# Altium schematic sheet BlockDetector2.SchDoc
size A3
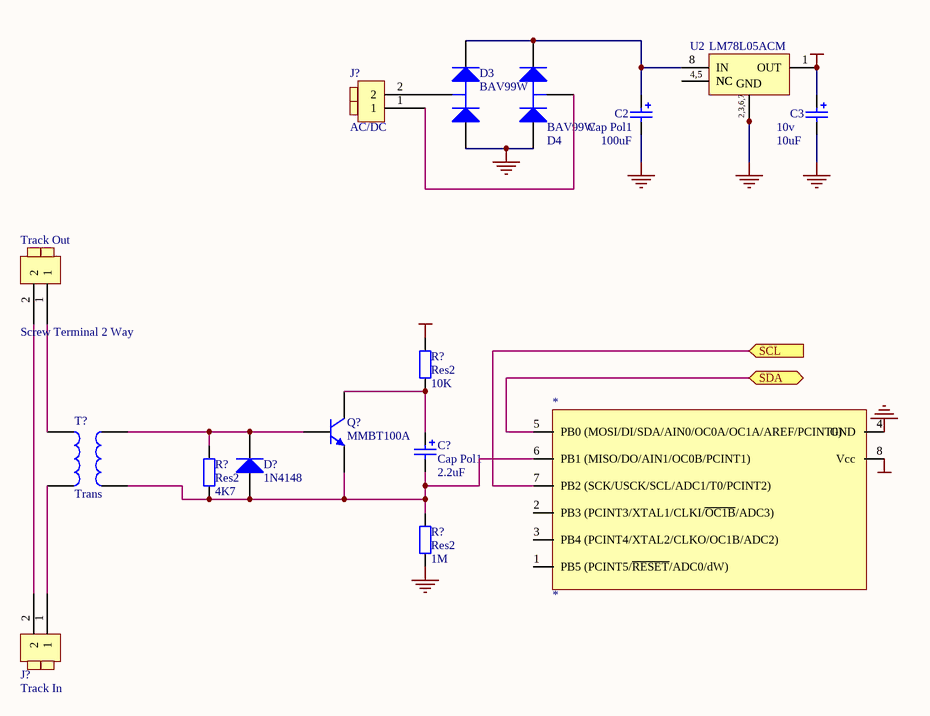
[diagram p0: BlockDetector2.SchDoc]

## Parts
(Parts that share a designator on the sheet are numbered #1, #2 ... from top to bottom, then left to right.)
*  *  [8P3]
C2  Cap Pol1  value 100uF  [CAPPR5-10X10.5]
C3  10v  value 10uF  [CC3216-1206]
C?  Cap Pol1  value 2.2uF  [RB7.6-15]
D3  BAV99W  [SOT-323]
D4  BAV99W  [SOT-323]
D?  1N4148  [DIO7.1-3.9x1.9]
J?#1  AC/DC  [Screw Terminal 2 way 0.2]
J?#2  Track In  [Screw Terminal 2 way 0.2]
Q?  MMBT100A  [SO-G3]
R?#1  Res2  value 10K  [AXIAL-0.4]
R?#2  Res2  value 4K7  [CR2012-0805]
R?#3  Res2  value 1M  [AXIAL-0.4]
T?  Trans  [TRANS]
Track_Out  Screw Terminal 2 Way  [Screw Terminal 2 way 0.2]
U2  LM78L05ACM  [M08A]

## Ports
SCL (in), SDA (bidir)

## Nets
GND: *.4(GND) C2.2 C3.2 D3.1(A) D4.1(A) R?#3.1 U2.2(GND) U2.3(GND) U2.6(GND) U2.7(GND)
VCC: *.8(Vcc) C3.1 R?#1.2 U2.1(OUT)
SCL: *.7(PB2_(SCK/USCK/SCL/ADC1/T0/PCINT2)) ; port SCL
SDA: *.5(PB0_(MOSI/DI/SDA/AIN0/OC0A/OC1A/AREF/PCINT0)) ; port SDA
Net*_6: *.6(PB1_(MISO/DO/AIN1/OC0B/PCINT1)) C?.2 D?.1(A) Q?.2(E) R?#2.1 R?#3.2 T?.4
NetC2_1: C2.1 D3.2(K) D4.2(K) U2.8(IN)
NetC?_1: C?.1 Q?.3(C) R?#1.1
NetD3_3: D3.3(C) J?#1.2
NetD4_3: D4.3(C) J?#1.1
NetD?_2: D?.2(K) Q?.1(B) R?#2.2 T?.3
NetJ?#2_1: J?#2.1 T?.2
NetJ?#2_2: J?#2.2 Track_Out.2
NetT?_1: T?.1 Track_Out.1
NetU2_4: U2.4(NC) U2.5(NC)

Not connected (* = marked no-connect by the designer): * 1(PB5_(PCINT5/~{RESET}/ADC0/dW)) 2(PB3_(PCINT3/XTAL1/CLKI/~{OC1B}/ADC3)) 3(PB4_(PCINT4/XTAL2/CLKO/OC1B/ADC2))

## Notes on the sheet
- (in symbol LM78L05ACM) 4,5; 2,3,6,7

## Library data of the parts
* = ATTINY45
C2 C3 C? = Cap Pol1: Polarized Capacitor (Radial); Published: 8-Jun-2000; Revision: July-2002: Re-released for DXP Platform.; Publisher: Altium Limited
D3 D4 = BAV99W: Silicon Switching Diode Array for High-Speed Switching; Package Information: Latest Revision: Sep-2001; Published: 21-Mar-2003; Datasheet: Latest Revision: Oct-1999; Package Reference: SOT-323; Publisher: Altium Limited
D? = Diode 1N4148: High Conductance Fast Diode; Revision 1: 11-Jul-2000: SIM Model Added.; Revision 2: 17-Jul-2002: Re-released for DXP Platform.; Code - JEDEC: DO-204-AH; Published: 8-Jun-2000; Datasheet: Latest Revision: 1997; Package Reference: DO-35; Publisher: Altium Limited
J?#1 J?#2 = Screw Terminal 2 Way
Q? = MMBT100A: General Purpose Amplifier NPN Silicon; Package Information: Latest Revision: 1997; Published: 29-Sep-2000; Revision: 17-Jul-2002: Re-released for DXP Platform.; Datasheet: Latest Revision: 1996; Package Reference: 318-08; Publisher: Altium Limited
R?#1-R?#3 = Res2: Resistor; Published: 8-Jun-2000; Revision: July-2002: Re-released for DXP Platform.; Publisher: Altium Limited
T? = Trans: Transformer; Published: 24-Mar-1999; Revision: July-2002: Re-released for DXP Platform.; Publisher: Altium Limited
U2 = LM78L05ACM: 3-Terminal Positive Regulator; Package Information: Latest Revision: Sep-1997; Code - JEDEC: MS-012-AA; Code - IPC: SO8; Published: 15-Apr-2002; Revision: 17-Sep-2003: Changed SIM name.; Datasheet: Latest Revision: Sep-1999; Package Reference: M08A; Publisher: Altium Limited